# Altium schematic sheet 5_Ble.SchDoc
size A
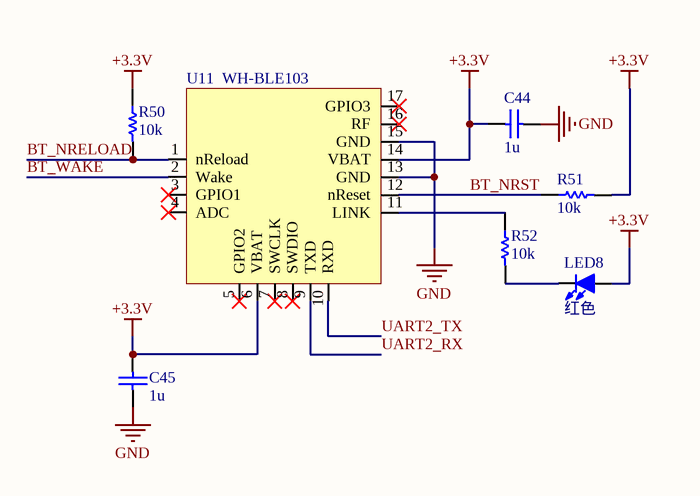
[diagram p0: 5_Ble.SchDoc]

## Parts
C44  1u  [CAP_0603_SMD]
C45  1u  [CAP_0603_SMD]
LED8  红色  [LED0603_Y]
R50  10k  [RES_0603_SMD]
R51  10k  [RES_0603_SMD]
R52  10k  [RES_0603_SMD]
U11  WH-BLE103  [PCBComponent_1]

## Nets
+3.3V: C44.2 C45.1 LED8.1(A) R50.1 R51.2 U11.6(VBAT) U11.14(VBAT)
GND: C44.1 C45.2 U11.13(GND) U11.15(GND)
BT_NRELOAD: R50.2 U11.1(nReload)
BT_NRST: R51.1 U11.12(nReset)
BT_WAKE: U11.2(Wake)
UART2_RX: U11.9(TXD)
UART2_TX: U11.10(RXD)
NetLED8_2: LED8.2(K) R52.2
NetR52_1: R52.1 U11.11(LINK)

Not connected (* = marked no-connect by the designer): U11 3(GPIO1)* 4(ADC)* 5(GPIO2)* 7(SWCLK)* 8(SWDIO)* 16(RF)* 17(GPIO3)*

## Library data of the parts
C44 C45 = CAP_0603_SMD: Capacitor, 0603, SMD; Published: 8-Jun-2000; LatestRevisionDate: 17-Jul-2002; LatestRevisionNote: Re-released for DXP Platform.; PackageReference: RAD-0.3; Publisher: Altium Limited
LED8 = LED-SMD: 贴片LED; 封装库来自淘宝卖家 ID：黄晶宝石: 其他店铺购入均为假冒，请立即申请退款，本店奖励现金5~20元; BOM名称: 贴片LED
R50-R52 = RES_0603_SMD: Resistor, 0603, SMD; Published: 8-Jun-2000; LatestRevisionDate: 17-Jul-2002; LatestRevisionNote: Re-released for DXP Platform.; PackageReference: AXIAL-0.3; Publisher: Altium Limited; Value: Value